# EAGLE design untitled (EAGLE 9.6.2)
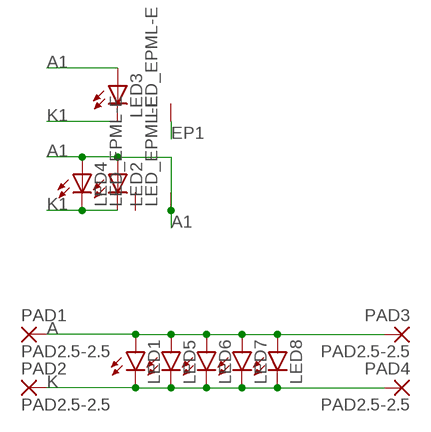
[diagram p0: schematic, sheet 1]

## Parts
LED1  LEDSIDELED  [OSRAM-SIDELED]
LED2  LED_EPML-E  [ML-E]
LED3  LED_EPML-E  [ML-E]
LED4  LED_EPML-E  [ML-E]
LED5  LEDSIDELED  [OSRAM-SIDELED]
LED6  LEDSIDELED  [OSRAM-SIDELED]
LED7  LEDSIDELED  [OSRAM-SIDELED]
LED8  LEDSIDELED  [OSRAM-SIDELED]
PAD1  PAD2.5-2.5  [SMD2,5-2,5]
PAD2  PAD2.5-2.5  [SMD2,5-2,5]
PAD3  PAD2.5-2.5  [SMD2,5-2,5]
PAD4  PAD2.5-2.5  [SMD2,5-2,5]

## Nets
A: LED1.A LED5.A LED6.A LED7.A LED8.A PAD1.1(P) PAD3.1(P)
A1: LED2.A@1(A) LED2.A@2(A) LED2.TH(EP) LED3.A@1(A) LED3.A@2(A) LED4.A@1(A) LED4.A@2(A)
EP1: LED3.TH(EP)
K: LED1.C LED5.C LED6.C LED7.C LED8.C PAD2.1(P) PAD4.1(P)
K1: LED2.C@1(C) LED2.C@2(C) LED3.C@1(C) LED3.C@2(C) LED4.C@1(C) LED4.C@2(C)
Unconnected: LED4.TH(EP)

## Library data of the parts
LED1 LED5-LED8 = led:LED: LED OSRAM: - CHIPLED LG R971, LG N971, LY N971, LG Q971, LY Q971, LO R971, LY R971 LH N974, LH R974 LS Q976, LO Q976, LY Q976 LO Q996 - Hyper CHIPLED LW Q18S LB Q993, LB Q99A, LB R99A - SideLED LS A670, LO A670, LY A670, LG A670, LP A670 LB A673, LV A673, LT A673, LW A673 LH A674 LY A675 LS A676, LA A676, LO A676, LY A676, LW A676 LS A679, LY A679, LG A679 - Hyper Micro SIDELED® LS Y876, LA Y876, LO Y876, LY Y876 LT Y87S - SmartLED LW L88C, LW L88S LB L89C, LB L89S, LG L890 LS L89K, LO L89K, LY L89K LS L896, LA L896, LO L896, LY L896 - TOPLED LS T670, LO T670, LY T670, LG T670, LP T670 LSG T670, LSP T670, LSY T670, LOP T670, LYG T670 LG T671, LOG T671, LSG T671 LB T673, LV T673, LT T673, LW T673 LH T674 LS T676, LA T676, LO T676, LY T676, LB T676, LH T676, LSB T676, LW T676 LB T67C, LV T67C, LT T67C, LS T67K, LO T67K, LY T67K, LW E67C LS E67B, LA E67B, LO E67B, LY E67B, LB E67C, LV E67C, LT E67C LW T67C LS T679, LY T679, LG T679 LS T770, LO T770, LY T770, LG T770, LP T770 LB T773, LV T773, LT T773, LW T773 LH T774 LS E675, LA E675, LY E675, LS T675 LS T776, LA T776, LO T776, LY T776, LB T776 LHGB T686 LT T68C, LB T68C - Hyper Mini TOPLED® LB M676 - Mini TOPLED Santana® LG M470 LS M47K, LO M47K, LY M47K Source: http://www.osram.convergy.de LUXEON: - LUMILED® LXK2-PW12-R00, LXK2-PW12-S00, LXK2-PW14-U00, LXK2-PW14-V00 LXK2-PM12-R00, LXK2-PM12-S00, LXK2-PM14-U00 LXK2-PE12-Q00, LXK2-PE12-R00, LXK2-PE12-S00, LXK2-PE14-T00, LXK2-PE14-U00 LXK2-PB12-K00, LXK2-PB12-L00, LXK2-PB12-M00, LXK2-PB14-N00, LXK2-PB14-P00, LXK2-PB14-Q00 LXK2-PR12-L00, LXK2-PR12-M00, LXK2-PR14-Q00, LXK2-PR14-R00 LXK2-PD12-Q00, LXK2-PD12-R00, LXK2-PD12-S00 LXK2-PH12-R00, LXK2-PH12-S00 LXK2-PL12-P00, LXK2-PL12-Q00, LXK2-PL12-R00 Source: www.luxeon.com KINGBRIGHT: KA-3528ASYC Source: www.kingbright.com
LED2-LED4 = 0 my parts:LED_EP
PAD1-PAD4 = 0 my parts:PAD

## Board
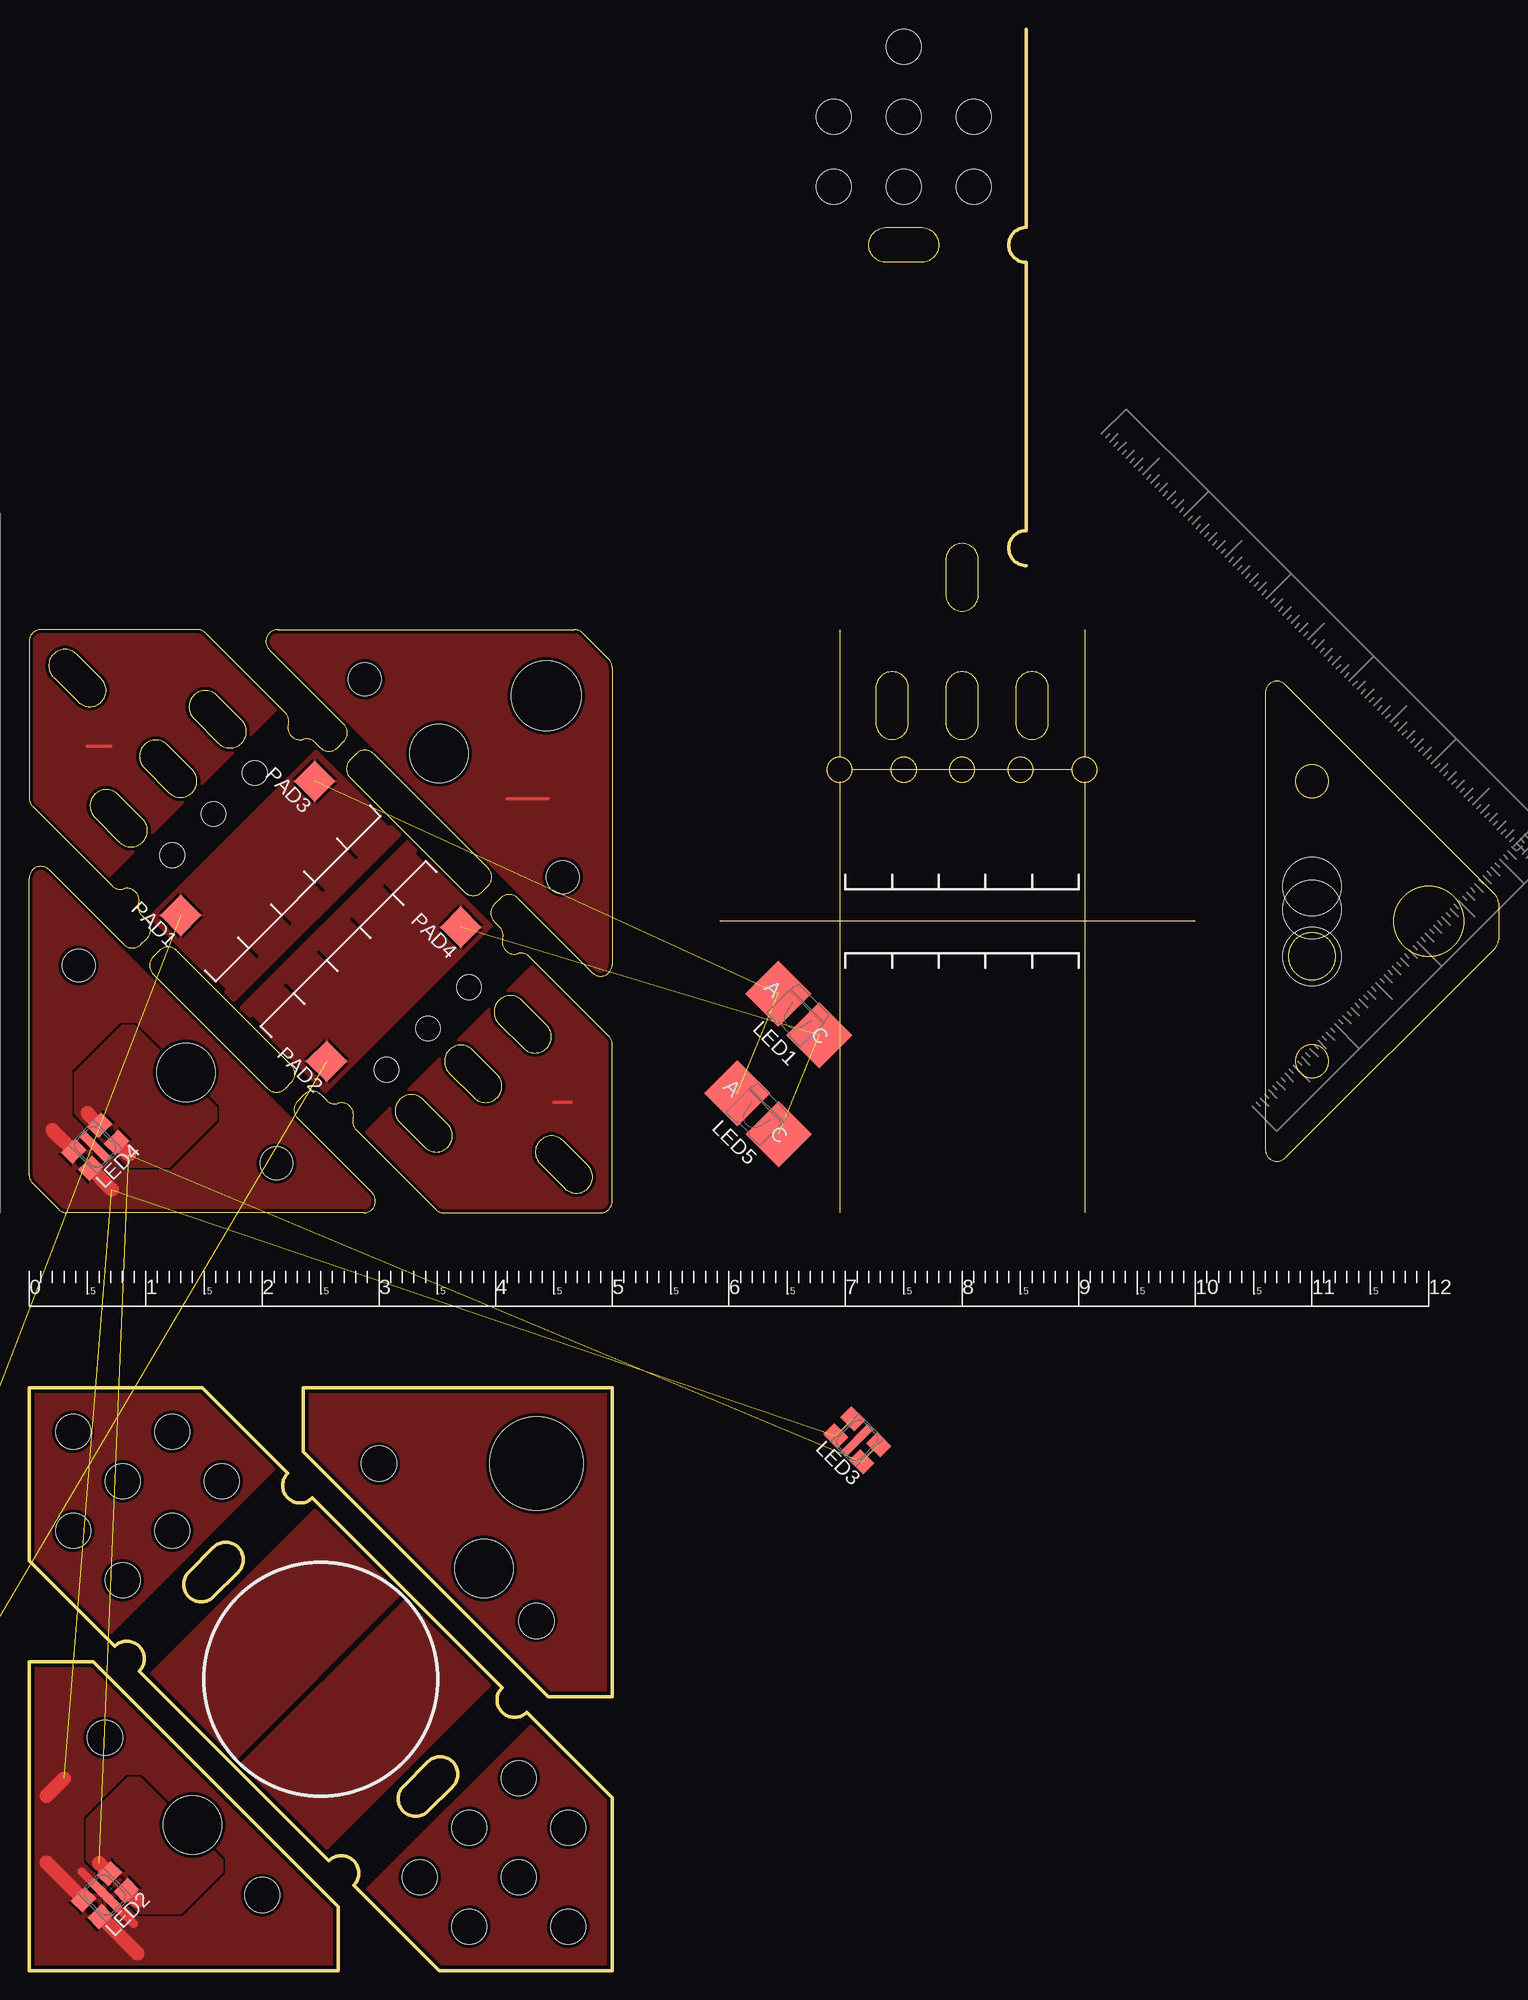
[diagram p1: board, top side]

Size 126 x 166.5 mm. Coordinates in mm from the lower left corner, seen from the top.
Outline: 85.5,166.5 85.5,149.5 arc90 84,148 arc90 85.5,146.5 85.5,123.5 arc90 84,122 arc90 85.5,120.5
Outline: 100,90 59.23,90
Outline: 90.5,115 90.5,104.05
Outline: 90.5,101.95 90.5,65
Outline: 69.5,115 69.5,104.05
Outline: 69.5,101.95 69.5,65
Outline: 89.45,103 70.55,103
Outline: 73.5,149.5 76.5,149.5 arc-90 78,148 arc-90 76.5,146.5 73.5,146.5 arc-90 72,148 arc-90 73.5,149.5
Outline: 13.69,34.19 15.81,36.31 arc-90 17.93,36.31 arc-90 17.93,34.19 15.81,32.07 arc-90 13.69,32.07 arc-90 13.69,34.19
Outline: 36.31,15.81 34.19,13.69 arc-90 32.07,13.69 arc-90 32.07,15.81 34.19,17.93 arc-90 36.31,17.93 arc-90 36.31,15.81
Outline: 50,50 23.5,50 23.5,44.5 44.5,23.5 50,23.5 50,50
Outline: 0,0 26.5,0 26.5,5.5 5.5,26.5 0,26.5 0,0
Outline: 24.29,40.56 arc-90 22.17,40.56 arc-90 22.17,42.68 14.85,50 0,50 0,35.15 7.32,27.83 arc-90 9.44,27.83 arc-90 9.44,25.71 25.71,9.44 arc-90 27.83,9.44 arc-90 27.83,7.32 35.15,0 50,0 50,14.85 42.68,22.17 arc-90 40.56,22.17 arc-90 40.56,24.29 24.29,40.56
Outline: 14.44,115 1,115 arc90 0,114 0,100.56 arc45 0.29,99.86 7.12,93.03 arc61 8.1,92.78 arc-122 9.39,91.48 arc61 9.65,90.5 10.12,90.03 arc-90 10.12,88.55 9.58,88.02 arc-90 8.1,88.02 1.71,94.41 arc135 0,93.7 0,68.24 arc45 0.29,67.54 2.54,65.29 arc45 3.24,65 28.7,65 arc135 29.41,66.71 23.02,73.1 arc-90 23.02,74.58 23.55,75.11 arc-90 25.04,75.11 25.5,74.65 arc61 26.48,74.39 arc-122 27.78,73.1 arc61 28.03,72.12 34.86,65.29 arc45 35.56,65 49,65 arc90 50,66 50,79.44 arc45 49.71,80.14 42.88,86.97 arc61 41.9,87.22 arc-122 40.61,88.52 arc61 40.35,89.5 39.88,89.97 arc-90 39.88,91.45 40.42,91.98 arc-90 41.9,91.98 48.29,85.59 arc135 50,86.3 50,111.76 arc45 49.71,112.46 47.46,114.71 arc45 46.76,115 21.3,115 arc135 20.59,113.29 26.98,106.9 arc-90 26.98,105.42 26.45,104.88 arc-90 24.96,104.88 24.5,105.35 arc61 23.52,105.61 arc-122 22.22,106.9 arc61 21.97,107.88 15.14,114.71 arc45 14.44,115
Outline: 107.71,110.29 125.71,92.29 arc-45 126,91.59 126,88.41 arc-45 125.71,87.71 107.71,69.71 arc-135 106,70.41 106,109.59 arc-135 107.71,110.29
Outline: 28.04,104.36 27.51,103.82 arc90 27.51,102.34 37.34,92.51 arc90 38.82,92.51 39.36,93.04 arc90 39.36,94.53 29.53,104.36 arc90 28.04,104.36
Outline: 11.18,87.49 10.64,86.96 arc90 10.64,85.47 20.47,75.64 arc90 21.96,75.64 22.49,76.18 arc90 22.49,77.66 12.66,87.49 arc90 11.18,87.49
Outline: 72.6,110 72.6,107 arc180 75.4,107 75.4,110 arc180 72.6,110
Outline: 81.4,107 81.4,110 arc180 78.6,110 78.6,107 arc180 81.4,107
Outline: 87.4,107 87.4,110 arc180 84.6,110 84.6,107 arc180 87.4,107
Outline: 81.4,118 81.4,121 arc180 78.6,121 78.6,118 arc180 81.4,118
Outline: 9.73,98.77 7.61,100.89 arc180 5.62,98.91 7.75,96.79 arc180 9.73,98.77
Outline: 13.97,103.01 11.85,105.13 arc180 9.87,103.15 11.99,101.03 arc180 13.97,103.01
Outline: 18.21,107.25 16.09,109.38 arc180 14.11,107.4 16.23,105.27 arc180 18.21,107.25
Outline: 2.09,110.93 4.21,108.81 arc180 6.19,110.79 4.07,112.91 arc180 2.09,110.93
Outline: 40.27,81.23 42.4,79.11 arc180 44.38,81.09 42.25,83.21 arc180 40.27,81.23
Outline: 36.03,76.99 38.15,74.87 arc180 40.13,76.85 38.01,78.97 arc180 36.03,76.99
Outline: 31.79,72.75 33.91,70.62 arc180 35.89,72.61 33.77,74.73 arc180 31.79,72.75
Outline: 47.91,69.07 45.79,71.19 arc180 43.81,69.21 45.93,67.09 arc180 47.91,69.07
Outline: circle at 80,103 radius 1.05
Outline: circle at 90.5,103 radius 1.05
Outline: circle at 69.5,103 radius 1.05
Outline: circle at 85,103 radius 1.05
Outline: circle at 75,103 radius 1.05
Outline: circle at 110,102 radius 1.4
Outline: circle at 110,78 radius 1.4
Outline: circle at 110,87 radius 2
Outline: circle at 120,90 radius 3
Copper layers (1*16): Top 0.035mm / dielectric 1.5mm / Bottom 0.035mm
Design rules "default *": minimum track width 6mil, minimum drill 0.35mm, track to track 6mil, track to pad 6mil, pad to pad 6mil, via to via 6mil, smd to smd 6mil, copper to edge 0.3mm, drill to drill 6mil, minimum pad ring 10mil, minimum via ring 8mil, stop-mask expansion 4mil, vias tented up to drill 0mil, thermal gap 10mil
Holes 3 mm at 46.21,3.79 75,153 81,153 69,153 75,165 75,159 81,159 69,159 37.73,12.27 33.49,8.03 41.97,16.51 41.97,8.03 37.73,3.79 46.21,12.27 12.27,37.73 16.51,41.97 8.03,33.49 3.79,46.21 8.03,41.97 12.27,46.21 3.79,37.73 6.5,20 20,6.5 43.5,30 30,43.5
Holes 5 mm at 39,34.5 14,12.5 110,91 110,87 13.44,77.02 110,93 35.15,104.39
Holes 8 mm at 43.5,43.5
Holes 6 mm at 120,90 44.34,109.34
Holes 2.8 mm at 110,102 110,78 28.79,110.76 45.76,93.79 21.21,69.24 4.24,86.21
Holes 2.1 mm at 75,103 80,103 85,103 12.27,95.66 15.81,99.19 19.34,102.73 37.73,84.34 34.19,80.81 30.66,77.27
tRestrict: 30 lines

### Footprints (pad centres in the part's own frame; a part is rotated, then mirrored left to right if it is on the bottom)
OSRAM-SIDELED = smd 4 x 4: A 0,2.5; C 0,-2.5
ML-E = smd 1.7 x 1.35: A@1 1.575,-1.025; A@2 1.575,1.025; C@1 -1.575,-1.025; C@2 -1.575,1.025 | smd 0.7 x 3.2: TH 0,0
SMD2,5-2,5 = smd 2.5 x 2.5: 1 0,0

### Placement (x,y rotation side)
LED1  66,82 45 top
LED2  6.5,6.5 225 top
LED3  71,45.5 135 top
LED4  5.66,70.66 225 top
LED5  62.5,73.5 45 top
LED6  -19,5 0 top  (outside the outline)
LED7  -28,5 0 top  (outside the outline)
LED8  -37,5 0 top  (outside the outline)
PAD1  13,90.5 45 top
PAD2  25.5,78 45 top
PAD3  24.5,102 45 top
PAD4  37,89.5 45 top
U$1  [RULER-S]  136.5,91.5 135 top  (outside the outline)
U$2  [RULER-S]  -2.5,65 90 top
U$3  [RULER]  0,57 0 top
U$4  [RULER-S]  107,72 45 top

### Tracks (layer width: path | path; a pad name or v marks a point on that pad's centre or on a via)
A  (5 unrouted)
  pour Top (no thermals): 10.5,25.5 24.5,39.5 31.75,32.25 17.75,18.25
  pour Top: 10,90 25,105 32.25,97.75 17.25,82.75
A1  (3 unrouted)
  Top 0.7: 9,4 LED2.TH 4.5,8.5
  Top 1.2: LED2.A@2 9.27,1.5 | LED2.A@1 1.5,9.27 | 1.5,15 3,16.5 | LED4.A@1 2,72.09 | LED4.A@2 7.09,67
  pour Top (rank 6): 0,0 26.5,0 26.5,5.5 5.5,26.5 0,26.5
  pour Top (rank 6): 0,65 31.5,65 0,96.5
EP6
  pour Top: 50,50 23.5,50 23.5,44.5 44.5,23.5 50,23.5
K  (5 unrouted)
  pour Top (no thermals): 39.5,24.5 25.5,10.5 18.25,17.75 32.25,31.75
  pour Top: 40,90 25,75 17.75,82.25 32.75,97.25
K1  (3 unrouted)
  Top 1.2: LED2.C@2 9.23,6 | LED2.C@1 6,9.23 | LED4.C@2 8.54,70 | LED4.C@1 5,73.54
  pour Top: 16.5,9.5 9.5,16.5 8.5,16.5 5,13 5,9.5 9.5,5 13,5 16.5,8.5
  pour Top: 16,74 9,81 8,81 4,77 4,73.5 8.5,69 12,69 16,73
N$1
  pour Top: 0,50 14.5,50 21.25,43.25 6.75,28.75 0,35.5
N$2
  pour Top: 28.75,6.75 43.25,21.25 50,14.5 50,0 35.5,0
N$5
  Top 0.3: 44.5,100.5 41,100.5
  pour Top: 50,115 18.5,115 50,83.5
N$6
  Top 0.3: 5,105 7,105
  pour Top: 0,115 15,115 21.5,108.5 6.5,93.5 0,100
N$7
  Top 0.3: 46.5,74.5 45,74.5
  pour Top: 28.75,71.75 43.5,86.5 50,80 50,65 35.5,65